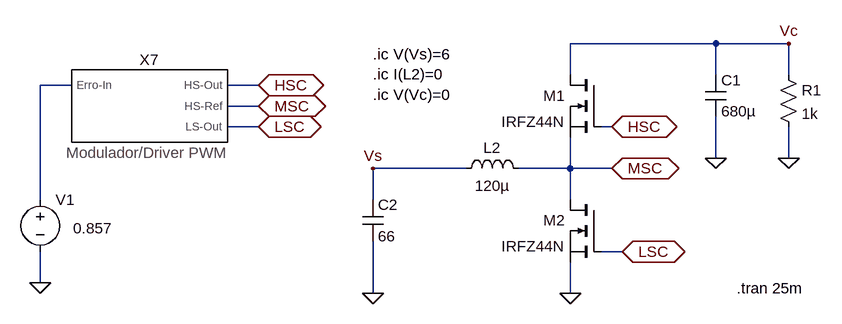
[diagram p0: schematic Conversor_boost.asc]
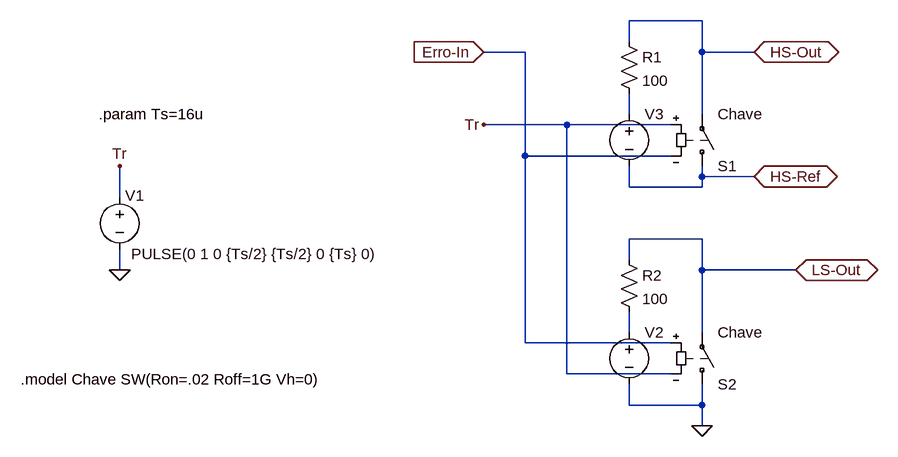
[diagram p1: sub-circuit modulador_pwm_driver.asc]
Conversor_boost.asc, the LTspice schematic file:
Version 4
SHEET 1 2244 924
WIRE 256 -32 32 -32
WIRE 368 -32 256 -32
WIRE 32 16 32 -32
WIRE 256 16 256 -32
WIRE 368 16 368 -32
WIRE -736 32 -784 32
WIRE -448 32 -496 32
WIRE -448 64 -496 64
WIRE -448 96 -496 96
WIRE 96 96 80 96
WIRE 256 144 256 80
WIRE 368 144 368 96
WIRE -128 160 -272 160
WIRE 32 160 32 112
WIRE 32 160 -48 160
WIRE 96 160 32 160
WIRE -784 208 -784 32
WIRE -272 208 -272 160
WIRE 32 208 32 160
WIRE 112 288 80 288
WIRE -784 336 -784 288
WIRE -272 352 -272 272
WIRE 32 352 32 304
FLAG -448 32 HSC
IOPIN -448 32 BiDir
FLAG -448 96 LSC
IOPIN -448 96 BiDir
FLAG -448 64 MSC
IOPIN -448 64 BiDir
FLAG -272 352 0
FLAG 112 288 LSC
IOPIN 112 288 BiDir
FLAG 32 352 0
FLAG 96 160 MSC
IOPIN 96 160 BiDir
FLAG 96 96 HSC
IOPIN 96 96 BiDir
FLAG -272 160 Vs
FLAG -784 336 0
FLAG 256 144 0
FLAG 368 144 0
FLAG 368 -32 Vc
SYMBOL ind -144 176 R270
WINDOW 0 32 56 VTop 2
WINDOW 3 5 56 VBottom 2
SYMATTR InstName L2
SYMATTR Value 120µ
SYMATTR SpiceLine Ipk=29 Rser=20m
SYMBOL cap -288 208 R0
SYMATTR InstName C2
SYMATTR Value 66
SYMATTR SpiceLine Irms=80 Rser=20m Rpar=8k
SYMBOL modulador_PWM_driver -624 64 R0
SYMATTR InstName X7
SYMBOL voltage -784 192 R0
WINDOW 123 0 0 Left 0
WINDOW 39 24 124 Left 2
WINDOW 3 51 60 Left 2
SYMATTR Value 0.857
SYMATTR InstName V1
SYMBOL cap 240 16 R0
SYMATTR InstName C1
SYMATTR Value 680µ
SYMATTR SpiceLine V=100 Rser=0
SYMBOL res 352 0 R0
SYMATTR InstName R1
SYMATTR Value 1k
SYMBOL nmos 80 16 M0
SYMATTR InstName M1
SYMATTR Value IRFZ44N
SYMBOL nmos 80 208 M0
SYMATTR InstName M2
SYMATTR Value IRFZ44N
TEXT -272 -16 Left 2 !.ic V(Vs)=6\n.ic I(L2)=0\n.ic V(Vc)=0
TEXT 288 344 Left 2 !.tran 25m

modulador_pwm_driver.asc, the sub-circuit schematic file:
Version 4
SHEET 1 1388 680
WIRE 1104 -16 992 -16
WIRE 992 16 992 -16
WIRE 832 32 768 32
WIRE 1104 32 1104 -16
WIRE 1184 32 1104 32
WIRE 992 128 992 96
WIRE 1104 128 1104 32
WIRE 896 144 768 144
WIRE 1056 144 896 144
WIRE 832 192 832 32
WIRE 1056 192 832 192
WIRE 1104 224 1104 208
WIRE 1184 224 1104 224
WIRE 992 240 992 208
WIRE 1104 240 1104 224
WIRE 1104 240 992 240
WIRE 208 256 208 208
WIRE 1104 320 992 320
WIRE 992 352 992 320
WIRE 208 368 208 336
WIRE 1104 368 1104 320
WIRE 1248 368 1104 368
WIRE 992 464 992 432
WIRE 1104 464 1104 368
WIRE 832 480 832 192
WIRE 1056 480 832 480
WIRE 896 528 896 144
WIRE 1056 528 896 528
WIRE 992 576 992 544
WIRE 1104 576 1104 544
WIRE 1104 576 992 576
WIRE 1104 608 1104 576
FLAG 1184 32 HS-Out
IOPIN 1184 32 BiDir
FLAG 1248 368 LS-Out
IOPIN 1248 368 BiDir
FLAG 1184 224 HS-Ref
IOPIN 1184 224 BiDir
FLAG 768 32 Erro-In
IOPIN 768 32 In
FLAG 208 368 0
FLAG 208 208 Tr
FLAG 1104 608 0
FLAG 768 144 Tr
SYMBOL voltage 208 240 R0
WINDOW 3 18 103 Left 2
WINDOW 123 0 0 Left 2
WINDOW 0 9 13 Left 2
SYMATTR Value PULSE(0 1 0 {Ts/2} {Ts/2} 0 {Ts} 0)
SYMATTR InstName V1
SYMATTR SpiceLine Rser=0
SYMBOL sw 1104 560 M180
SYMATTR InstName S2
SYMATTR Value Chave
SYMBOL res 976 336 R0
SYMATTR InstName R2
SYMATTR Value 100
SYMBOL voltage 992 448 R0
WINDOW 3 24 96 Invisible 2
WINDOW 123 0 0 Left 2
SYMATTR Value 16
SYMATTR SpiceLine Rser=0
SYMATTR InstName V2
SYMBOL sw 1104 224 M180
SYMATTR InstName S1
SYMATTR Value Chave
SYMBOL res 976 0 R0
SYMATTR InstName R1
SYMATTR Value 100
SYMBOL voltage 992 112 R0
WINDOW 3 24 96 Invisible 2
WINDOW 123 0 0 Left 2
SYMATTR Value 16
SYMATTR SpiceLine Rser=0
SYMATTR InstName V3
TEXT 176 128 Left 2 !.param Ts=16u
TEXT 56 536 Left 2 !.model Chave SW(Ron=.02 Roff=1G Vh=0)

The netlist it stands for:
* Conversor_boost.asc
L2 Vs MSC 120µ Ipk=29 Rser=20m
C2 Vs 0 66 Irms=80 Rser=20m Rpar=8k
XX7 N001 HSC MSC LSC modulador_pwm_driver
V1 N001 0 0.857
C1 Vc 0 680µ V=100 Rser=0
R1 Vc 0 1k
M1 Vc HSC MSC MSC IRFZ44N
M2 MSC LSC 0 0 IRFZ44N

* block symbol definitions
.subckt modulador_pwm_driver Erro-In HS-Out HS-Ref LS-Out
V1 Tr 0 PULSE(0 1 0 {Ts/2} {Ts/2} 0 {Ts} 0) Rser=0
S2 0 LS-Out Erro-In Tr Chave
R2 LS-Out N002 100
V2 N002 0 16 Rser=0
S1 HS-Ref HS-Out Tr Erro-In Chave
R1 HS-Out N001 100
V3 N001 HS-Ref 16 Rser=0
.param Ts=16u
.model Chave SW(Ron=.02 Roff=1G Vh=0)
.ends modulador_pwm_driver

.model NMOS NMOS
.model PMOS PMOS
.lib standard.mos
.ic V(Vs)=6
.ic I(L2)=0
.ic V(Vc)=0
.tran 25m
.backanno
.end